# Altium project FPGA2.PrjPcb (part 2 of 2)

## Sheet MODULES.SchDoc
size 389 x 250 mm; SheetNumber: 8; SheetTotal: 8
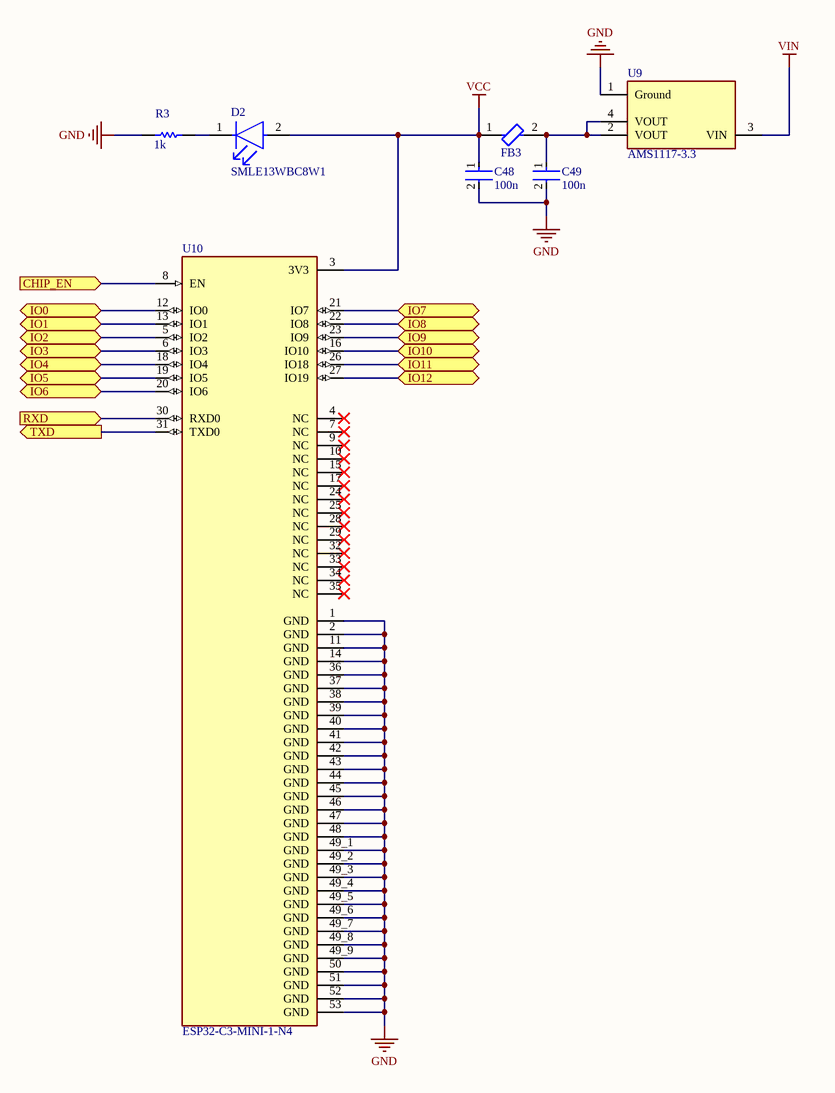
[diagram p7: MODULES.SchDoc]

### Parts
C48  100n  [FP-CL10-IPC_C]
C49  100n  [FP-CL10-IPC_C]
D2  SMLE13WBC8W1  [FP-SMLE13WBC8W1-MFG]
FB3  BLM18KG121TN1D  [FP-BLM18-0_15-t0_6-d1_2-IPC_A]  (value not drawn)
R3  1k  [RESC2013X60X35ML10T20]
U9  AMS1117-3.3  [FP-AMS1117-IPC_C]
U10  ESP32-C3-MINI-1-N4  [XCVR_ESP32-C3-MINI-1-N4]

### Ports
CHIP_EN (in), IO0 (bidir), IO1 (bidir), IO2 (bidir), IO3 (bidir), IO4 (bidir), IO5 (bidir), IO6 (bidir), IO7 (bidir), IO8 (bidir), IO9 (bidir), IO10 (bidir), IO11 (bidir), IO12 (bidir), RXD (in), TXD (out)

### Nets
GND: C48.2 C49.2 R3.1 U9.1(Ground) U10.1(GND) U10.2(GND) U10.11(GND) U10.14(GND) U10.36(GND) U10.37(GND) U10.38(GND) U10.39(GND) U10.40(GND) U10.41(GND) U10.42(GND) U10.43(GND) U10.44(GND) U10.45(GND) U10.46(GND) U10.47(GND) U10.48(GND) U10.49_1(GND) U10.49_2(GND) U10.49_3(GND) U10.49_4(GND) U10.49_5(GND) U10.49_6(GND) U10.49_7(GND) U10.49_8(GND) U10.49_9(GND) U10.50(GND) U10.51(GND) U10.52(GND) U10.53(GND)
VCC: C48.1 D2.2(A) FB3.1 U10.3(3V3)
VIN: U9.3(VIN)
NetC49_1: C49.1 FB3.2 U9.2(VOUT) U9.4(VOUT)
NetD2_1: D2.1(C) R3.2
NetU1_AB4: U10.31(TXD0) ; port TXD
NetU1_AB5: U10.30(RXD0) ; port RXD
NetU1_AB6: U10.27(IO19) ; port IO12
NetU1_AB7: U10.26(IO18) ; port IO11
NetU1_AB8: U10.23(IO9) ; port IO9
NetU1_AB9: U10.22(IO8) ; port IO8
NetU1_AB10: U10.21(IO7) ; port IO7
NetU1_AB11: U10.20(IO6) ; port IO6
NetU1_AB12: U10.19(IO5) ; port IO5
NetU1_AB13: U10.18(IO4) ; port IO4
NetU1_AB14: U10.16(IO10) ; port IO10
NetU1_AB15: U10.13(IO1) ; port IO1
NetU1_AB16: U10.12(IO0) ; port IO0
NetU1_AB17: U10.8(EN) ; port CHIP_EN
NetU1_AB18: U10.6(IO3) ; port IO3
NetU1_AB19: U10.5(IO2) ; port IO2

Not connected (* = marked no-connect by the designer): U10 4(NC)* 7(NC)* 9(NC)* 10(NC)* 15(NC)* 17(NC)* 24(NC)* 25(NC)* 28(NC)* 29(NC)* 32(NC)* 33(NC)* 34(NC)* 35(NC)*

### Library data of the parts
C48 C49 = CMP-13271-003017-1: Cap Ceramic 4.7uF 10V X5R ±10% Pad SMD 0603 +85°C T/R; Capacitance: 4.7uF; Case/Package: 0603; Packaging: Tape and Reel; Width: 0.031inch; Contact Plating: Tin; Thickness: 0.035inch; Package Quantity: 1; Voltage Rating: 10V; Case Code (Metric): 1608; Case Code (Imperial): 0603; Depth: 0.8mm; Height: 0.8mm; Tolerance: 10%; Max Operating Temperature: 85°C; Length: 1.6mm; Dielectric: X5R; Mount: Surface Mount; Radiation Hardening: No; Min Operating Temperature: -55°C
D2 = CMP-08952-000004-1: LED WHITE 0603 SMD; Manufacturer: Rohm; Luminous Intensity: 140mcd; Led Orientation: Top View; Reverse Voltage: 5V; Forward Voltage: 2.9V; Forward Current: 5mA; Power Dissipation: 66mW; Temperature Range Low: -40°C; Digikey Description: LED WHITE 0603 SMD; Temperature Range High: +85°C; Temperature: -40°C to +85°C; Manufacturer Part Number: SMLE13WBC8W1; Colour: White; Mouser Description: Standard LEDs - SMD ExceLED White LED 120mcd 5mA; Octopart: https://octopart.com/smle13wbc8w1-rohm-22224565; Automotive: No; Device Class L2: LEDs; Lead Free: Yes; ComponentLink2URL: https://media.digikey.com/pdf/Data%20Sheets/Rohm%20PDFs/SMLE13WBC8W1_Spec.pdf; Device Class L3: unset; Package: 0; RoHS: TRUE; Height: 0.4mm; Category: Diode; Device Class L1: Optoelectronics; ComponentLink2Description: Datasheet
FB3 = CMP-0686-00554-8: FERRITE BEAD 120 OHM 0603 1LN; Max Current Rating: 3A; DC Resistance (DCR): 30mR; Impedance: 120R; Number of Lines: 1; Test Frequency: 100MHz; Tolerance: 25%; Package Quantity: 4000; Min Operating Temperature: -55°C; Termination: SMD/SMT; REACH SVHC: No SVHC; Core Material: Ferrite; Material: Ferrite; Current Rating: 3A; Height: 0.8mm; Number of Pins: 2; Case/Package: 0603; Case Code (Imperial): 0603; Series: BLM18K; Packaging: Tape and Reel; Inductor Type: FERRITE BEAD; Lead Free: Lead Free; Width: 0.8mm; Case Code (Metric): 1608; Number of Circuits: 1; Max DC Current: 3A; Depth: 0.95mm; Max Operating Temperature: 125°C; Length: 1.6mm; RoHS Compliant: Yes
R3 = CMP-2100-03673-1: Chip Resistor, 0 Ohm, Jumper, +/- 5%, 0.125 W, -55 to 155 degC, 0805 (2012 Metric), RoHS, Tape and Reel; Manufacturer: Yageo; Power Rating: 125mW; Resistance: 0mOhm; Voltage Rating (DC): 150V; Temperature Coefficient: 200ppm/degreesC; Height: 0.5mm; Depth: 1.25mm; Case Code (Imperial): 0805; Lead Free: LeadFree; Military Standard: Not; Package Description: 2-Pin Surface Mounted Device, Body 2 x 1.25 mm; Case Code (Metric): 2012; Composition: ThickFilm; Voltage Rating: 150V; Manufacturer URL: http://www.yageo.com/; Packaging: TapeandReel; Package Reference: 0805; REACH SVHC: Unknown; Tolerance: 5%; Case/Package: 0805; Max Operating Temperature: 155degC; Number of Pins: 2; Min Operating Temperature: -55degC; RoHSCompliant: true; Length: 2mm; Datasheet URL: http://www.yageo.com/NewPortal/yageodocoutput?fileName=/pdf/R-Chip/PYu-RC_Group_51_RoHS_L_5.pdf; Termination: SMD/SMT; Radiation Hardening: No; Width: 1.25mm; Contact Plating: Tin; Datasheet Version: Rev. 5, 10/2016
U9 = CMP-209535-000001-1: LDO Voltage Regulators 1A, 3.3V; Manufacturer: Advanced Monolithic Systems; Dropout Voltage: 1.1V; Output Type: Fixed; Nominal Supply Current: 5mA; Max Power Dissipation: 1.2W; Max Supply Voltage: 15V; Number Of Outputs: 1; Standoff Height: 0.64mm; Max Junction Temp: +125°C; Height: 1.8mm; Package: AMS1117; Device Class L2: Power Management ICs; ComponentLink2Description: Datasheet; ComponentLink2URL: http://www.advanced-monolithic.com/pdf/ds1117.pdf; Category: IC; RoHS: TRUE; Automotive: No; Device Class L1: Integrated Circuits (ICs); Output Current: 1A; Device Class L3: Voltage Regulators - Linear; Temperature: -40°C to +125°C; Output Voltage: 3.3V; Manufacturer Part Number: AMS1117-3.3; Temperature Range Low: -40°C; Octopart: https://octopart.com/ams1117-3.3-advanced+monolithic+systems-25899300; Lead Free: Yes; Ipc Land Pattern Name: SOT229P700X180-4; Temperature Range High: +125°C
U10 = ESP32-C3-MINI-1-N4: Bluetooth, WiFi 802.11b/g/n, Bluetooth v5.0 Transceiver Module 2.412GHz ~ 2.484GHz PCB Trace Surface Mount; MF: Espressif Systems; SnapEDA_Link: https://www.snapeda.com/parts/ESP32-C3-MINI-1-N4/Espressif+Systems/view-part/?ref=snap; Package: SMD-53 Espressif Systems; Value: *; MP: ESP32-C3-MINI-1-N4; Check_prices: https://www.snapeda.com/parts/ESP32-C3-MINI-1-N4/Espressif+Systems/view-part/?ref=eda

## Nets that join several sheets
GND: spartan6-0 (U1.F10 U1.F15 U1.G11 U1.L19), spartan6-2 (106 pins), MEMORY (14 pins), POWER (16 pins), CONNECTORS (21 pins), CONNECTORS2 (24 pins), MODULES (34 pins)
VCC: spartan6-1 (6 pins), spartan6-2 (104 pins), MEMORY (9 pins), POWER (14 pins), CONNECTORS (J2.4), CONNECTORS2 (6 pins), MODULES (C48.1 D2.2 FB3.1 U10.3)
VIN: spartan6-2 (U2.3), POWER (C36.P FB1.2 P1.1), CONNECTORS2 (U8.3), MODULES (U9.3)
0_N: spartan6-0 (U1.C22), CONNECTORS (J1.3)
0_P: spartan6-0 (U1.B22), CONNECTORS (J1.1)
1_N: spartan6-0 (U1.E22), CONNECTORS (J1.6)
1_P: spartan6-0 (U1.D22), CONNECTORS (J1.4)
2_N: spartan6-0 (U1.G22), CONNECTORS (J1.9)
2_P: spartan6-0 (U1.F22), CONNECTORS (J1.7)
3_N: spartan6-0 (U1.J22), CONNECTORS (J1.12)
3_P: spartan6-0 (U1.H22), CONNECTORS (J1.10)
AUX_N: spartan6-0 (U1.L22), CONNECTORS (J1.17)
AUX_P: spartan6-0 (U1.K22), CONNECTORS (J1.15)
clk: spartan6-0 (5 pins), spartan6-1 (10 pins), spartan6-2 (Y1.4), CONNECTORS (J3.A5 J3.B5), CONNECTORS2 (U7.6)
NetJ2_1: spartan6-1 (U1.AA18), CONNECTORS (J2.1)
NetJ2_2: spartan6-1 (U1.AA16), CONNECTORS (J2.2)
NetJ2_7: spartan6-1 (U1.AA14), CONNECTORS (J2.7)
NetJ2_8: spartan6-1 (U1.AA12), CONNECTORS (J2.8)
NetJ4_3: spartan6-0 (U1.A3), MEMORY (U4.19), CONNECTORS2 (J4.3)
NetJ4_4: spartan6-0 (U1.B3), MEMORY (U4.18), CONNECTORS2 (J4.4)
NetJ4_5: spartan6-0 (U1.E6), MEMORY (U4.17), CONNECTORS2 (J4.5)
NetJ4_6: spartan6-0 (U1.E5), MEMORY (U4.16), CONNECTORS2 (J4.6)
NetJ4_7: spartan6-0 (U1.A2), MEMORY (U4.15), CONNECTORS2 (J4.7)
NetJ4_8: spartan6-0 (U1.B2), MEMORY (U4.13), CONNECTORS2 (J4.8)
NetJ4_9: spartan6-0 (U1.D5), MEMORY (U4.12), CONNECTORS2 (J4.9)
NetJ4_10: spartan6-0 (U1.D4), MEMORY (U4.11), CONNECTORS2 (J4.10)
NetJ5_3: spartan6-0 (U1.B18), MEMORY (U5.11), CONNECTORS2 (J5.3)
NetJ5_4: spartan6-0 (U1.A18), MEMORY (U5.12), CONNECTORS2 (J5.4)
NetJ5_5: spartan6-0 (U1.C19), MEMORY (U5.13), CONNECTORS2 (J5.5)
NetJ5_6: spartan6-0 (U1.A19), MEMORY (U5.15), CONNECTORS2 (J5.6)
NetJ5_7: spartan6-0 (U1.B20), MEMORY (U5.16), CONNECTORS2 (J5.7)
NetJ5_8: spartan6-0 (U1.A20), MEMORY (U5.17), CONNECTORS2 (J5.8)
NetJ5_9: spartan6-0 (U1.D17), MEMORY (U5.18), CONNECTORS2 (J5.9)
NetJ5_10: spartan6-0 (U1.C18), MEMORY (U5.19), CONNECTORS2 (J5.10)
NetJ6_3: MEMORY (U3.12), CONNECTORS2 (J6.3)
NetJ6_4: MEMORY (U3.11), CONNECTORS2 (J6.4)
NetJ6_5: MEMORY (U3.9), CONNECTORS2 (J6.5)
NetJ6_6: MEMORY (U3.8), CONNECTORS2 (J6.6)
NetJ6_7: MEMORY (U3.6), CONNECTORS2 (J6.7)
NetJ6_8: MEMORY (U3.5), CONNECTORS2 (J6.8)
NetJ6_9: MEMORY (U3.3), CONNECTORS2 (J6.9)
NetJ6_10: MEMORY (U3.2), CONNECTORS2 (J6.10)
NetJ7_3: MEMORY (U3.13), CONNECTORS2 (J7.3)
NetJ7_4: MEMORY (U3.14), CONNECTORS2 (J7.4)
NetJ7_5: MEMORY (U3.16), CONNECTORS2 (J7.5)
NetJ7_6: MEMORY (U3.17), CONNECTORS2 (J7.6)
NetJ7_7: MEMORY (U3.19), CONNECTORS2 (J7.7)
NetJ7_8: MEMORY (U3.20), CONNECTORS2 (J7.8)
NetJ7_9: MEMORY (U3.22), CONNECTORS2 (J7.9)
NetJ7_10: MEMORY (U3.23), CONNECTORS2 (J7.10)
NetJ8_1: spartan6-2 (U1.D20), CONNECTORS2 (J8.1)
NetJ8_3: spartan6-2 (U1.E18), CONNECTORS2 (J8.3)
NetJ8_7: spartan6-2 (U1.G17), CONNECTORS2 (J8.7)
NetJ8_9: spartan6-2 (U1.A21), CONNECTORS2 (J8.9 J8.11)
NetR10_2: spartan6-0 (U1.P19), MEMORY (5 pins)
NetU1_AA1: spartan6-1 (U1.AA1), MEMORY (U4.23)
NetU1_AA2: spartan6-1 (U1.AA2), MEMORY (U4.21)
NetU1_AB4: spartan6-1 (U1.AB4), MODULES (U10.31)
NetU1_AB5: spartan6-1 (U1.AB5), MODULES (U10.30)
NetU1_AB6: spartan6-1 (U1.AB6), MODULES (U10.27)
NetU1_AB7: spartan6-1 (U1.AB7), MODULES (U10.26)
NetU1_AB8: spartan6-1 (U1.AB8), MODULES (U10.23)
NetU1_AB9: spartan6-1 (U1.AB9), MODULES (U10.22)
NetU1_AB10: spartan6-1 (U1.AB10), MODULES (U10.21)
NetU1_AB11: spartan6-1 (U1.AB11), MODULES (U10.20)
NetU1_AB12: spartan6-1 (U1.AB12), MODULES (U10.19)
NetU1_AB13: spartan6-1 (U1.AB13), MODULES (U10.18)
NetU1_AB14: spartan6-1 (U1.AB14), MODULES (U10.16)
NetU1_AB15: spartan6-1 (U1.AB15), MODULES (U10.13)
NetU1_AB16: spartan6-1 (U1.AB16), MODULES (U10.12)
NetU1_AB17: spartan6-1 (U1.AB17), MODULES (U10.8)
NetU1_AB18: spartan6-1 (U1.AB18), MODULES (U10.6)
NetU1_AB19: spartan6-1 (U1.AB19), MODULES (U10.5)
NetU1_C17: spartan6-0 (U1.C17), CONNECTORS2 (U7.5)
NetU1_G16: spartan6-0 (U1.G16), CONNECTORS2 (U7.1)
NetU1_H14: spartan6-0 (U1.H14), CONNECTORS2 (U7.2)
NetU1_M7: spartan6-1 (U1.M7), MEMORY (U5.6)
NetU1_M8: spartan6-1 (U1.M8), MEMORY (U5.7)
NetU1_M16: spartan6-0 (U1.M16), MEMORY (U3.47)
NetU1_M17: spartan6-0 (U1.M17), MEMORY (U3.38)
NetU1_M18: spartan6-0 (U1.M18), MEMORY (U3.37)
NetU1_N6: spartan6-1 (U1.N6), MEMORY (U4.2)
NetU1_N7: spartan6-1 (U1.N7), MEMORY (U4.26)
NetU1_N15: spartan6-0 (U1.N15), MEMORY (U3.46)
NetU1_N16: spartan6-0 (U1.N16), MEMORY (U3.41)
NetU1_P4: spartan6-1 (U1.P4), MEMORY (U4.24)
NetU1_P5: spartan6-1 (U1.P5), MEMORY (U4.25)
NetU1_P6: spartan6-1 (U1.P6), MEMORY (U5.9)
NetU1_P7: spartan6-1 (U1.P7), MEMORY (U5.8)
NetU1_P8: spartan6-1 (U1.P8), MEMORY (U4.9)
NetU1_P16: spartan6-0 (U1.P16), MEMORY (U3.40)
NetU1_P17: spartan6-0 (U1.P17), MEMORY (U3.33)
NetU1_P18: spartan6-0 (U1.P18), MEMORY (U3.32)
NetU1_R4: spartan6-1 (U1.R4), MEMORY (U5.5)
NetU1_R7: spartan6-1 (U1.R7), MEMORY (U4.10)
NetU1_R15: spartan6-0 (U1.R15), MEMORY (U3.36)
NetU1_R16: spartan6-0 (U1.R16), MEMORY (U3.35)
NetU1_R17: spartan6-0 (U1.R17), MEMORY (U3.30)
NetU1_T3: spartan6-1 (U1.T3), MEMORY (U5.4)
NetU1_T4: spartan6-1 (U1.T4), MEMORY (U5.10)
NetU1_T5: spartan6-1 (U1.T5), MEMORY (U4.5)
NetU1_T6: spartan6-1 (U1.T6), MEMORY (U4.6)
NetU1_T17: spartan6-0 (U1.T17), MEMORY (U3.29)
NetU1_T18: spartan6-0 (U1.T18), MEMORY (U3.26)
NetU1_T19: spartan6-0 (U1.T19), MEMORY (U3.27)
NetU1_T20: spartan6-0 (U1.T20), MEMORY (U3.43)
NetU1_U1: spartan6-1 (U1.U1), MEMORY (U5.3)
NetU1_U3: spartan6-1 (U1.U3), MEMORY (U5.26)
NetU1_U4: spartan6-1 (U1.U4), MEMORY (U4.1)
NetU1_U19: spartan6-0 (U1.U19), MEMORY (U3.44)
NetU1_V1: spartan6-1 (U1.V1), MEMORY (U5.2)
NetU1_V2: spartan6-1 (U1.V2), MEMORY (U5.24)
NetU1_V3: spartan6-1 (U1.V3), MEMORY (U4.3)
NetU1_V5: spartan6-1 (U1.V5), MEMORY (U4.4)
NetU1_W1: spartan6-1 (U1.W1), MEMORY (U5.21)
NetU1_W3: spartan6-1 (U1.W3), MEMORY (U5.25)
NetU1_W4: spartan6-1 (U1.W4), MEMORY (U4.8)
NetU1_Y1: spartan6-1 (U1.Y1), MEMORY (U5.23)
NetU1_Y2: spartan6-1 (U1.Y2), MEMORY (U5.1)
NetU1_Y3: spartan6-1 (U1.Y3), MEMORY (U4.7)
U0_N: spartan6-1 (U1.A6), CONNECTORS (J3.A6)
U0_P: spartan6-1 (U1.B6), CONNECTORS (J3.A7)
U1_N: spartan6-1 (U1.A8), CONNECTORS (J3.B7)
U1_P: spartan6-1 (U1.B8), CONNECTORS (J3.B6)